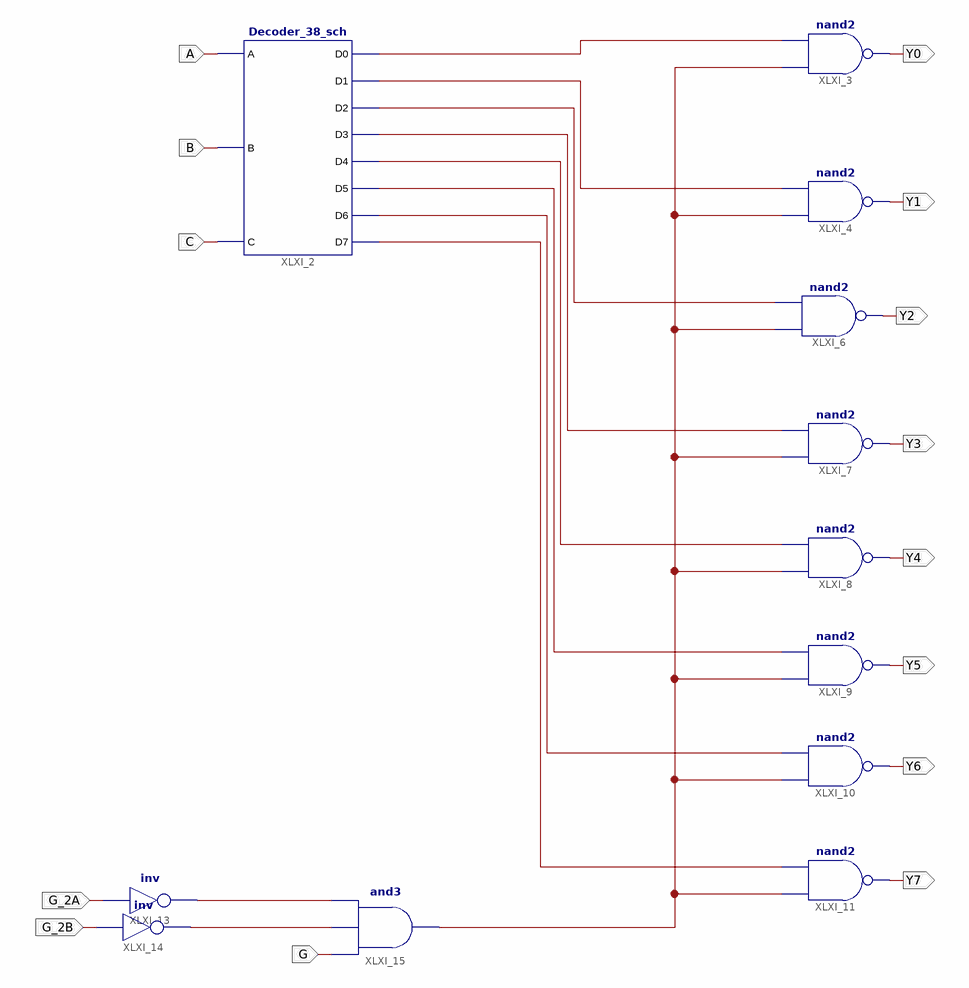
[diagram p0: schematic sheet 1]
// Xilinx ISE schematic HCT138_sch.sch (kintex7) as structural Verilog: 12 symbols, 14 ports
module HCT138_sch (
  input  A,
  input  B,
  input  C,
  input  G_2A,
  input  G_2B,
  input  G,
  output Y0,
  output Y1,
  output Y2,
  output Y3,
  output Y4,
  output Y5,
  output Y6,
  output Y7
);

  wire XLXN_1, XLXN_2, XLXN_3, XLXN_4, XLXN_5, XLXN_6, XLXN_7, XLXN_8, XLXN_9, XLXN_10, XLXN_11;

  Decoder_38_sch XLXI_2 (
    .A(A), .B(B), .C(C), .D0(XLXN_1), .D1(XLXN_2), .D2(XLXN_3), .D3(XLXN_4), .D4(XLXN_5), .D5(XLXN_6),
    .D6(XLXN_7), .D7(XLXN_8));
  nand XLXI_3 (Y0, XLXN_9, XLXN_1);
  nand XLXI_4 (Y1, XLXN_9, XLXN_2);
  nand XLXI_6 (Y2, XLXN_9, XLXN_3);
  nand XLXI_7 (Y3, XLXN_9, XLXN_4);
  nand XLXI_8 (Y4, XLXN_9, XLXN_5);
  nand XLXI_9 (Y5, XLXN_9, XLXN_6);
  nand XLXI_10 (Y6, XLXN_9, XLXN_7);
  nand XLXI_11 (Y7, XLXN_9, XLXN_8);
  not XLXI_13 (XLXN_10, G_2A);
  and XLXI_15 (XLXN_9, G, XLXN_11, XLXN_10);
  not XLXI_14 (XLXN_11, G_2B);
endmodule
